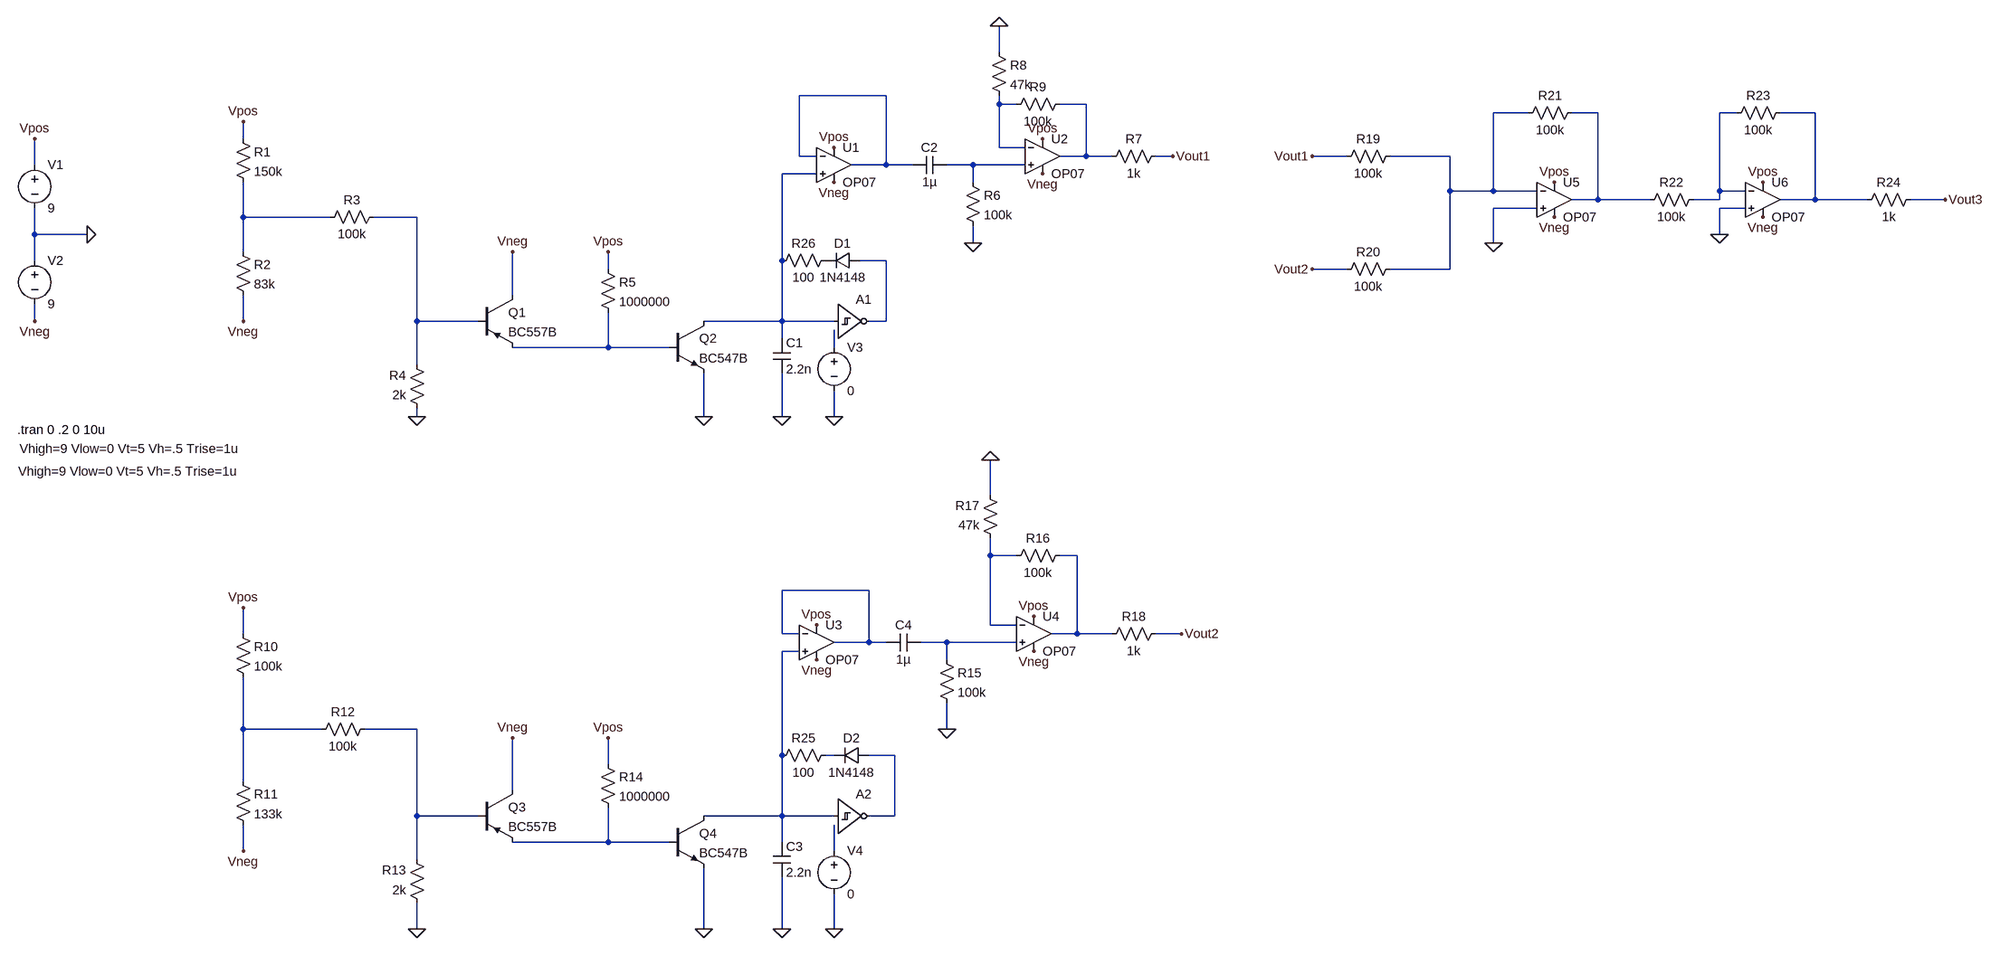
[diagram p0: schematic ENGR203_labfinal_huntchri.asc]
ENGR203_labfinal_huntchri.asc, the LTspice schematic file:
Version 4
SHEET 1 3720 1492
WIRE 1696 -144 1696 -192
WIRE 1488 -64 1328 -64
WIRE 1696 -48 1696 -64
WIRE 1728 -48 1696 -48
WIRE 1856 -48 1808 -48
WIRE 2864 -32 2800 -32
WIRE 2992 -32 2944 -32
WIRE 3248 -32 3216 -32
WIRE 3392 -32 3328 -32
WIRE 304 16 304 -16
WIRE 1696 32 1696 -48
WIRE 1744 32 1696 32
WIRE 1328 48 1328 -64
WIRE 1360 48 1328 48
WIRE 1856 48 1856 -48
WIRE 1856 48 1808 48
WIRE 1904 48 1856 48
WIRE 2016 48 1984 48
WIRE 2528 48 2464 48
WIRE 2720 48 2608 48
WIRE -80 64 -80 16
WIRE 1488 64 1488 -64
WIRE 1488 64 1424 64
WIRE 1536 64 1488 64
WIRE 1648 64 1600 64
WIRE 1744 64 1648 64
WIRE 1360 80 1296 80
WIRE 1648 96 1648 64
WIRE 2720 112 2720 48
WIRE 2800 112 2800 -32
WIRE 2800 112 2720 112
WIRE 2880 112 2800 112
WIRE 3216 112 3216 -32
WIRE 3264 112 3216 112
WIRE 2992 128 2992 -32
WIRE 2992 128 2944 128
WIRE 3088 128 2992 128
WIRE 3216 128 3216 112
WIRE 3216 128 3168 128
WIRE 3392 128 3392 -32
WIRE 3392 128 3328 128
WIRE 3488 128 3392 128
WIRE 3632 128 3568 128
WIRE 2880 144 2800 144
WIRE 3264 144 3216 144
WIRE 304 160 304 96
WIRE 464 160 304 160
WIRE 624 160 544 160
WIRE -80 192 -80 144
WIRE 16 192 -80 192
WIRE 3216 192 3216 144
WIRE 1648 208 1648 176
WIRE 2800 208 2800 144
WIRE 304 224 304 160
WIRE -80 240 -80 192
WIRE 1296 240 1296 80
WIRE 1488 240 1440 240
WIRE 976 256 976 224
WIRE 2528 256 2464 256
WIRE 2720 256 2720 112
WIRE 2720 256 2608 256
WIRE 800 304 800 224
WIRE -80 352 -80 320
WIRE 304 352 304 304
WIRE 624 352 624 160
WIRE 736 352 624 352
WIRE 1296 352 1296 240
WIRE 1296 352 1152 352
WIRE 1392 352 1296 352
WIRE 1488 352 1488 240
WIRE 1488 352 1456 352
WIRE 1296 384 1296 352
WIRE 976 400 976 336
WIRE 976 400 800 400
WIRE 1088 400 976 400
WIRE 1392 400 1392 368
WIRE 624 432 624 352
WIRE 624 528 624 512
WIRE 1152 528 1152 448
WIRE 1296 528 1296 448
WIRE 1392 528 1392 480
WIRE 1680 672 1680 608
WIRE 1680 784 1680 752
WIRE 1728 784 1680 784
WIRE 1840 784 1808 784
WIRE 1456 848 1296 848
WIRE 1680 912 1680 784
WIRE 1728 912 1680 912
WIRE 304 928 304 880
WIRE 1296 928 1296 848
WIRE 1328 928 1296 928
WIRE 1840 928 1840 784
WIRE 1840 928 1792 928
WIRE 1904 928 1840 928
WIRE 2032 928 1984 928
WIRE 1456 944 1456 848
WIRE 1456 944 1392 944
WIRE 1488 944 1456 944
WIRE 1600 944 1552 944
WIRE 1728 944 1600 944
WIRE 1328 960 1296 960
WIRE 1600 976 1600 944
WIRE 304 1104 304 1008
WIRE 448 1104 304 1104
WIRE 624 1104 528 1104
WIRE 1600 1104 1600 1056
WIRE 1296 1152 1296 960
WIRE 1392 1152 1376 1152
WIRE 1504 1152 1456 1152
WIRE 976 1168 976 1120
WIRE 304 1200 304 1104
WIRE 800 1216 800 1120
WIRE 624 1264 624 1104
WIRE 736 1264 624 1264
WIRE 1296 1264 1296 1152
WIRE 1296 1264 1152 1264
WIRE 1392 1264 1296 1264
WIRE 1504 1264 1504 1152
WIRE 1504 1264 1456 1264
WIRE 976 1312 976 1248
WIRE 976 1312 800 1312
WIRE 1088 1312 976 1312
WIRE 1296 1312 1296 1264
WIRE 304 1328 304 1280
WIRE 1392 1328 1392 1280
WIRE 624 1344 624 1264
WIRE 624 1472 624 1424
WIRE 1152 1472 1152 1360
WIRE 1296 1472 1296 1376
WIRE 1392 1472 1392 1408
FLAG 16 192 0
FLAG -80 16 Vpos
FLAG -80 352 Vneg
FLAG 976 224 Vpos
FLAG 800 224 Vneg
FLAG 624 528 0
FLAG 304 -16 Vpos
FLAG 304 352 Vneg
FLAG 1152 528 0
FLAG 1296 528 0
FLAG 1392 32 Vpos
FLAG 1392 96 Vneg
FLAG 1648 208 0
FLAG 1696 -192 0
FLAG 2016 48 Vout1
FLAG 1776 16 Vpos
FLAG 1776 80 Vneg
FLAG 800 1120 Vneg
FLAG 976 1120 Vpos
FLAG 1152 1472 0
FLAG 624 1472 0
FLAG 304 1328 Vneg
FLAG 304 880 Vpos
FLAG 1296 1472 0
FLAG 1392 528 0
FLAG 1392 1472 0
FLAG 1360 912 Vpos
FLAG 1360 976 Vneg
FLAG 1760 960 Vneg
FLAG 1760 896 Vpos
FLAG 1680 608 0
FLAG 2032 928 Vout2
FLAG 1600 1104 0
FLAG 2800 208 0
FLAG 3216 192 0
FLAG 3296 96 Vpos
FLAG 2912 96 Vpos
FLAG 2912 160 Vneg
FLAG 3296 160 Vneg
FLAG 2464 48 Vout1
FLAG 2464 256 Vout2
FLAG 3632 128 Vout3
SYMBOL voltage -80 48 R0
WINDOW 123 0 0 Left 0
WINDOW 39 0 0 Left 0
SYMATTR InstName V1
SYMATTR Value 9
SYMBOL voltage -80 224 R0
WINDOW 123 0 0 Left 0
WINDOW 39 0 0 Left 0
SYMATTR InstName V2
SYMATTR Value 9
SYMBOL res 288 0 R0
SYMATTR InstName R1
SYMATTR Value 150k
SYMBOL res 288 208 R0
SYMATTR InstName R2
SYMATTR Value 83k
SYMBOL res 560 144 R90
WINDOW 0 0 56 VBottom 2
WINDOW 3 32 56 VTop 2
SYMATTR InstName R3
SYMATTR Value 100k
SYMBOL res 640 528 R180
WINDOW 0 36 76 Left 2
WINDOW 3 36 40 Left 2
SYMATTR InstName R4
SYMATTR Value 2k
SYMBOL pnp 736 304 R0
SYMATTR InstName Q1
SYMATTR Value BC557B
SYMBOL res 960 240 R0
SYMATTR InstName R5
SYMATTR Value 1000000
SYMBOL npn 1088 352 R0
SYMATTR InstName Q2
SYMATTR Value BC547B
SYMBOL cap 1280 384 R0
SYMATTR InstName C1
SYMATTR Value 2.2n
SYMBOL Digital\\schmtinv 1392 288 R0
WINDOW 3 -1500 299 Left 2
SYMATTR Value Vhigh=9 Vlow=0 Vt=5 Vh=.5 Trise=1u
SYMATTR InstName A1
SYMBOL diode 1440 224 R90
WINDOW 0 0 32 VBottom 2
WINDOW 3 32 32 VTop 2
SYMATTR InstName D1
SYMATTR Value 1N4148
SYMBOL OpAmps\\OP07 1392 0 R0
SYMATTR InstName U1
SYMBOL cap 1600 48 R90
WINDOW 0 0 32 VBottom 2
WINDOW 3 32 32 VTop 2
SYMATTR InstName C2
SYMATTR Value 1µ
SYMBOL res 1632 80 R0
SYMATTR InstName R6
SYMATTR Value 100k
SYMBOL OpAmps\\OP07 1776 -16 R0
SYMATTR InstName U2
SYMBOL res 2000 32 R90
WINDOW 0 0 56 VBottom 2
WINDOW 3 32 56 VTop 2
SYMATTR InstName R7
SYMATTR Value 1k
SYMBOL res 1680 -160 R0
SYMATTR InstName R8
SYMATTR Value 47k
SYMBOL res 1824 -64 R90
WINDOW 0 0 56 VBottom 2
WINDOW 3 32 56 VTop 2
SYMATTR InstName R9
SYMATTR Value 100k
SYMBOL res 288 912 R0
SYMATTR InstName R10
SYMATTR Value 100k
SYMBOL res 288 1184 R0
SYMATTR InstName R11
SYMATTR Value 133k
SYMBOL res 544 1088 R90
WINDOW 0 0 56 VBottom 2
WINDOW 3 32 56 VTop 2
SYMATTR InstName R12
SYMATTR Value 100k
SYMBOL res 640 1440 R180
WINDOW 0 36 76 Left 2
WINDOW 3 36 40 Left 2
SYMATTR InstName R13
SYMATTR Value 2k
SYMBOL pnp 736 1216 R0
SYMATTR InstName Q3
SYMATTR Value BC557B
SYMBOL npn 1088 1264 R0
SYMATTR InstName Q4
SYMATTR Value BC547B
SYMBOL res 960 1152 R0
SYMATTR InstName R14
SYMATTR Value 1000000
SYMBOL cap 1280 1312 R0
SYMATTR InstName C3
SYMATTR Value 2.2n
SYMBOL Digital\\schmtinv 1392 1200 R0
WINDOW 3 -1502 -571 Left 2
SYMATTR Value Vhigh=9 Vlow=0 Vt=5 Vh=.5 Trise=1u
SYMATTR InstName A2
SYMBOL voltage 1392 384 R0
WINDOW 123 0 0 Left 0
WINDOW 39 0 0 Left 0
SYMATTR InstName V3
SYMATTR Value 0
SYMBOL voltage 1392 1312 R0
WINDOW 123 0 0 Left 0
WINDOW 39 0 0 Left 0
SYMATTR InstName V4
SYMATTR Value 0
SYMBOL diode 1456 1136 R90
WINDOW 0 0 32 VBottom 2
WINDOW 3 32 32 VTop 2
SYMATTR InstName D2
SYMATTR Value 1N4148
SYMBOL OpAmps\\OP07 1360 880 R0
SYMATTR InstName U3
SYMBOL cap 1552 928 R90
WINDOW 0 0 32 VBottom 2
WINDOW 3 32 32 VTop 2
SYMATTR InstName C4
SYMATTR Value 1µ
SYMBOL res 1584 960 R0
SYMATTR InstName R15
SYMATTR Value 100k
SYMBOL OpAmps\\OP07 1760 864 R0
SYMATTR InstName U4
SYMBOL res 1824 768 R90
WINDOW 0 0 56 VBottom 2
WINDOW 3 32 56 VTop 2
SYMATTR InstName R16
SYMATTR Value 100k
SYMBOL res 1696 768 R180
WINDOW 0 36 76 Left 2
WINDOW 3 36 40 Left 2
SYMATTR InstName R17
SYMATTR Value 47k
SYMBOL res 2000 912 R90
WINDOW 0 0 56 VBottom 2
WINDOW 3 32 56 VTop 2
SYMATTR InstName R18
SYMATTR Value 1k
SYMBOL res 2624 32 R90
WINDOW 0 0 56 VBottom 2
WINDOW 3 32 56 VTop 2
SYMATTR InstName R19
SYMATTR Value 100k
SYMBOL res 2624 240 R90
WINDOW 0 0 56 VBottom 2
WINDOW 3 32 56 VTop 2
SYMATTR InstName R20
SYMATTR Value 100k
SYMBOL OpAmps\\OP07 2912 64 R0
SYMATTR InstName U5
SYMBOL OpAmps\\OP07 3296 64 R0
SYMATTR InstName U6
SYMBOL res 2960 -48 R90
WINDOW 0 0 56 VBottom 2
WINDOW 3 32 56 VTop 2
SYMATTR InstName R21
SYMATTR Value 100k
SYMBOL res 3184 112 R90
WINDOW 0 0 56 VBottom 2
WINDOW 3 32 56 VTop 2
SYMATTR InstName R22
SYMATTR Value 100k
SYMBOL res 3344 -48 R90
WINDOW 0 0 56 VBottom 2
WINDOW 3 32 56 VTop 2
SYMATTR InstName R23
SYMATTR Value 100k
SYMBOL res 3584 112 R90
WINDOW 0 0 56 VBottom 2
WINDOW 3 32 56 VTop 2
SYMATTR InstName R24
SYMATTR Value 1k
SYMBOL res 1392 1136 R90
WINDOW 0 0 56 VBottom 2
WINDOW 3 32 56 VTop 2
SYMATTR InstName R25
SYMATTR Value 100
SYMBOL res 1392 224 R90
WINDOW 0 0 56 VBottom 2
WINDOW 3 32 56 VTop 2
SYMATTR InstName R26
SYMATTR Value 100
TEXT -112 552 Left 2 !.tran 0 .2 0 10u

The netlist it stands for:
* ENGR203_labfinal_huntchri.asc
V1 Vpos 0 9
V2 0 Vneg 9
R1 Vpos N010 150k
R2 N010 Vneg 83k
R3 N011 N010 100k
R4 0 N011 2k
Q1 Vneg N011 N013 0 BC557B
R5 Vpos N013 1000000
Q2 N009 N013 0 0 BC547B
C1 N009 0 2.2n
A1 N009 N014 N014 N014 N014 N012 N014 N014 SCHMITT Vhigh=9 Vlow=0 Vt=5 Vh=.5 Trise=1u
D1 N012 P001 1N4148
XU1 N009 N001 Vpos Vneg N001 LT1001  ; OP07, pins In+ In- V+ V- OUT
C2 N008 N001 1µ
R6 N008 0 100k
XU2 N008 N002 Vpos Vneg N003 LT1001  ; OP07, pins In+ In- V+ V- OUT
R7 Vout1 N003 1k
R8 0 N002 47k
R9 N003 N002 100k
R10 Vpos N020 100k
R11 N020 Vneg 133k
R12 N021 N020 100k
R13 0 N021 2k
Q3 Vneg N021 N024 0 BC557B
Q4 N019 N024 0 0 BC547B
R14 Vpos N024 1000000
C3 N019 0 2.2n
A2 N019 N025 N025 N025 N025 N023 N025 N025 SCHMITT Vhigh=9 Vlow=0 Vt=5 Vh=.5 Trise=1u
V3 N014 0 0
V4 N025 0 0
D2 N023 N022 1N4148
XU3 N019 N017 Vpos Vneg N017 LT1001  ; OP07, pins In+ In- V+ V- OUT
C4 N018 N017 1µ
R15 N018 0 100k
XU4 N018 N015 Vpos Vneg N016 LT1001  ; OP07, pins In+ In- V+ V- OUT
R16 N016 N015 100k
R17 N015 0 47k
R18 Vout2 N016 1k
R19 N004 Vout1 100k
R20 N004 Vout2 100k
XU5 0 N004 Vpos Vneg N005 LT1001  ; OP07, pins In+ In- V+ V- OUT
XU6 0 N006 Vpos Vneg N007 LT1001  ; OP07, pins In+ In- V+ V- OUT
R21 N005 N004 100k
R22 N006 N005 100k
R23 N007 N006 100k
R24 Vout3 N007 1k
R25 N022 N019 100
R26 P001 N009 100
.model D D
.lib standard.dio
.model NPN NPN
.model PNP PNP
.lib standard.bjt
.tran 0 .2 0 10u
.lib LTC.lib
.backanno
.end